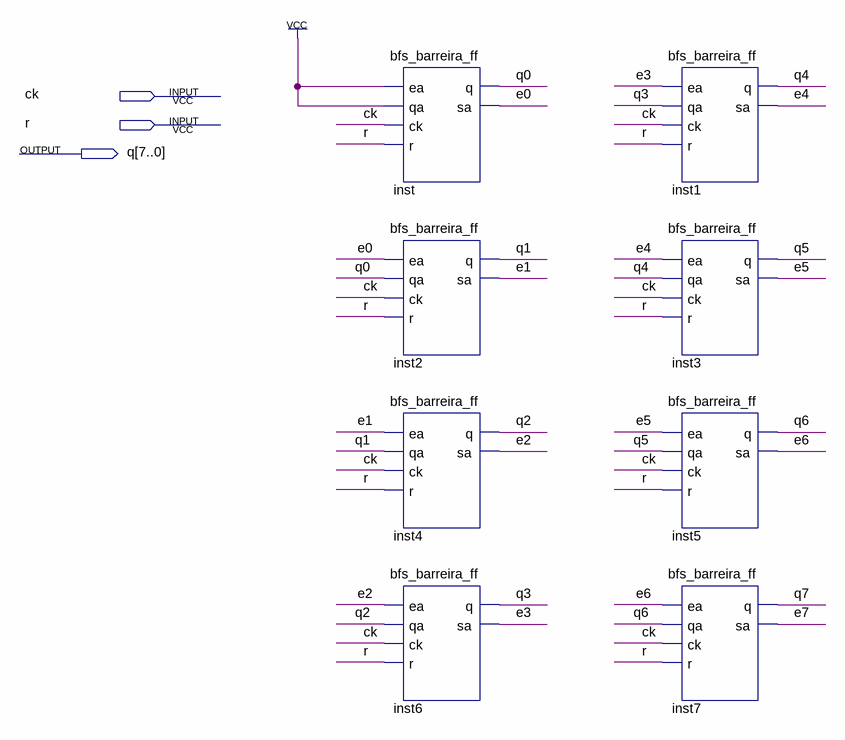
[diagram p0: schematic sheet]
// Quartus schematic bfs_contador_ff_8bits.bdf as structural Verilog: 8 symbols, 3 pins
module bfs_contador_ff_8bits (
  input  ck,
  input  r,
  output [7:0] q
);

  wire e0, e1, e2, e3, e4, e5, e6, e7;

  bfs_barreira_ff inst (.ea(1'b1), .qa(1'b1), .ck(ck), .r(r), .q(q[0]), .sa(e0));
  bfs_barreira_ff inst2 (.ea(e0), .qa(q[0]), .ck(ck), .r(r), .q(q[1]), .sa(e1));
  bfs_barreira_ff inst4 (.ea(e1), .qa(q[1]), .ck(ck), .r(r), .q(q[2]), .sa(e2));
  bfs_barreira_ff inst6 (.ea(e2), .qa(q[2]), .ck(ck), .r(r), .q(q[3]), .sa(e3));
  bfs_barreira_ff inst1 (.ea(e3), .qa(q[3]), .ck(ck), .r(r), .q(q[4]), .sa(e4));
  bfs_barreira_ff inst3 (.ea(e4), .qa(q[4]), .ck(ck), .r(r), .q(q[5]), .sa(e5));
  bfs_barreira_ff inst5 (.ea(e5), .qa(q[5]), .ck(ck), .r(r), .q(q[6]), .sa(e6));
  bfs_barreira_ff inst7 (.ea(e6), .qa(q[6]), .ck(ck), .r(r), .q(q[7]), .sa(e7));
endmodule
